# Altium schematic sheet Balanza.SchDoc
size A4
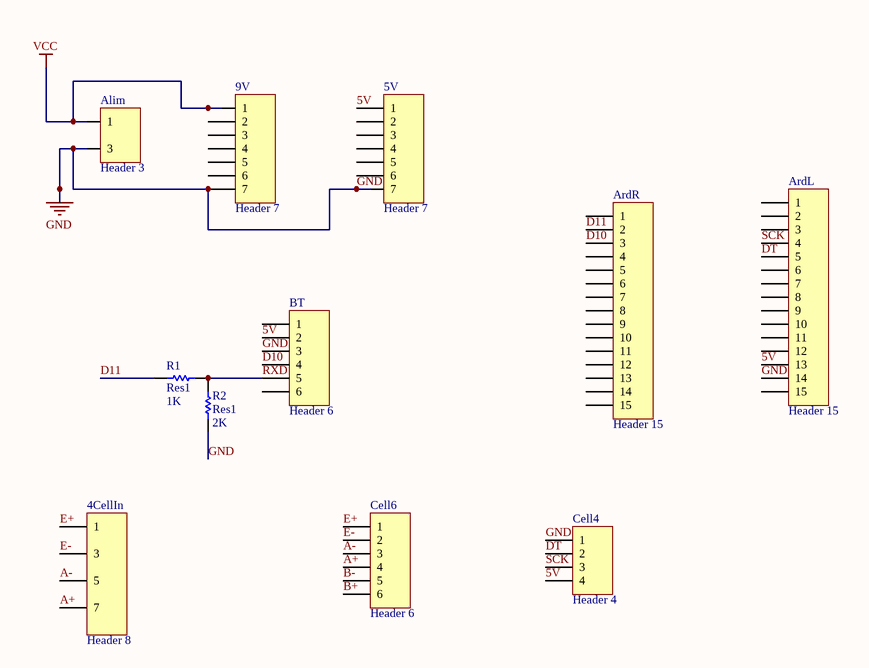
[diagram p0: Balanza.SchDoc]

## Parts
4CellIn  Header 8  [HDR1X8]
5V  Header 7  [HDR1X7]
9V  Header 7  [HDR1X7]
Alim  Header 3  [HDR1X3]
ArdL  Header 15  [HDR1X15]
ArdR  Header 15  [HDR1X15]
BT  Header 6  [HDR1X6]
Cell4  Header 4  [HDR1X4]
Cell6  Header 6  [HDR1X6]
R1  Res1  value 1K  [AXIAL-0.3]
R2  Res1  value 2K  [AXIAL-0.3]

## Nets
GND: 5V.7 9V.7 Alim.3 ArdL.14 BT.3 Cell4.1 R2.2
VCC: 9V.1 Alim.1
5V: 5V.1 ArdL.13 BT.2 Cell4.4
A+: 4CellIn.7 Cell6.4
A-: 4CellIn.5 Cell6.3
B+: Cell6.6
B-: Cell6.5
D10: ArdR.3 BT.4
D11: ArdR.2 R1.1
DT: ArdL.5 Cell4.2
E+: 4CellIn.1 Cell6.1
E-: 4CellIn.3 Cell6.2
RXD: BT.5 R1.2 R2.1
SCK: ArdL.4 Cell4.3

Not connected (* = marked no-connect by the designer): 5V 2 3 4 5 6; 9V 2 3 4 5 6; ArdL 1 2 3 6 7 8 9 10 11 12 15; ArdR 1 4 5 6 7 8 9 10 11 12 13 14 15; BT 1 6

## Library data of the parts
4CellIn = Header 8: Header, 8-Pin; LatestRevisionDate: 17-Jul-2002; LatestRevisionNote: Re-released for DXP Platform.; Publisher: Altium Limited
5V 9V = Header 7: Header, 7-Pin; LatestRevisionDate: 17-Jul-2002; LatestRevisionNote: Re-released for DXP Platform.; Publisher: Altium Limited
Alim = Header 3: Header, 3-Pin; LatestRevisionDate: 17-Jul-2002; LatestRevisionNote: Re-released for DXP Platform.; Publisher: Altium Limited
ArdL ArdR = Header 15: Header, 15-Pin; LatestRevisionDate: 17-Jul-2002; LatestRevisionNote: Re-released for DXP Platform.; Publisher: Altium Limited
BT Cell6 = Header 6: Header, 6-Pin; LatestRevisionDate: 17-Jul-2002; LatestRevisionNote: Re-released for DXP Platform.; Publisher: Altium Limited
Cell4 = Header 4: Header, 4-Pin; LatestRevisionDate: 17-Jul-2002; LatestRevisionNote: Re-released for DXP Platform.; Publisher: Altium Limited
R1 R2 = Res1: Resistor; Published: 8-Jun-2000; LatestRevisionDate: 17-Jul-2002; LatestRevisionNote: Re-released for DXP Platform.; PackageReference: AXIAL-0.3; Publisher: Altium Limited; PackageDescription: Axial Device, Thru-Hole; 2 Leads; 0.3 in Pin Spacing